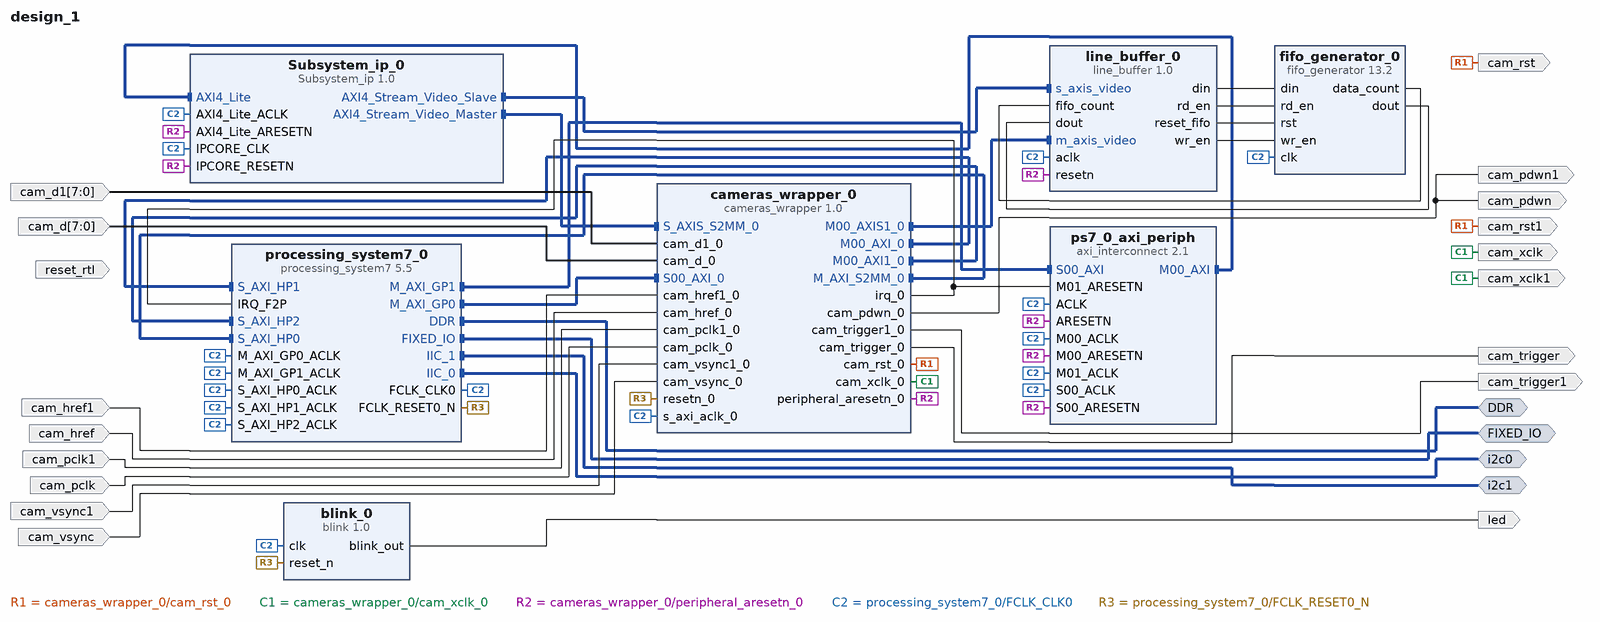
[diagram p0: block diagram of the top level]
# Vivado block design design_1, xc7z020clg400-3, Vivado 2019.1
create_bd_design design_1

create_bd_intf_port -mode Master -vlnv xilinx.com:interface:ddrx_rtl:1.0 DDR
create_bd_intf_port -mode Master -vlnv xilinx.com:display_processing_system7:fixedio_rtl:1.0 FIXED_IO
create_bd_intf_port -mode Master -vlnv xilinx.com:interface:iic_rtl:1.0 i2c0
create_bd_intf_port -mode Master -vlnv xilinx.com:interface:iic_rtl:1.0 i2c1
create_bd_port -dir I -from 7 -to 0 cam_d
create_bd_port -dir I -from 7 -to 0 cam_d1
create_bd_port -dir I cam_href
create_bd_port -dir I cam_href1
create_bd_port -dir I -type clk cam_pclk
create_bd_port -dir I -type clk cam_pclk1
create_bd_port -dir O cam_pdwn
create_bd_port -dir O cam_pdwn1
create_bd_port -dir O cam_rst
create_bd_port -dir O cam_rst1
create_bd_port -dir O cam_trigger
create_bd_port -dir O cam_trigger1
create_bd_port -dir I cam_vsync
create_bd_port -dir I cam_vsync1
create_bd_port -dir O -type clk cam_xclk
create_bd_port -dir O -type clk cam_xclk1
create_bd_port -dir O led
create_bd_port -dir I -type rst reset_rtl
set_property -dict {CONFIG.POLARITY ACTIVE_LOW} [get_bd_ports reset_rtl]

create_bd_cell -type ip -vlnv craftdrones:user:blink:1.0 blink_0
set_property -dict {CONFIG.max_count 50000000} [get_bd_cells blink_0]
create_bd_cell -type ip -vlnv xilinx.com:user:cameras_wrapper:1.0 cameras_wrapper_0
create_bd_cell -type ip -vlnv xilinx.com:ip:fifo_generator:13.2 fifo_generator_0
set_property -dict [list \
  CONFIG.Data_Count true \
  CONFIG.Data_Count_Width 12 \
  CONFIG.Enable_Safety_Circuit true \
  CONFIG.Full_Flags_Reset_Value 1 \
  CONFIG.Input_Data_Width 64 \
  CONFIG.Input_Depth 4096 \
  CONFIG.Output_Data_Width 64 \
  CONFIG.Reset_Type Asynchronous_Reset \
] [get_bd_cells fifo_generator_0]
create_bd_cell -type ip -vlnv xilinx.com:user:line_buffer:1.0 line_buffer_0
create_bd_cell -type ip -vlnv xilinx.com:ip:processing_system7:5.5 processing_system7_0
set_property -dict [list \
  CONFIG.PCW_APU_PERIPHERAL_FREQMHZ 667 \
  CONFIG.PCW_CPU_CPU_6X4X_MAX_RANGE 867 \
  CONFIG.PCW_ENET0_PERIPHERAL_ENABLE 0 \
  CONFIG.PCW_FPGA0_PERIPHERAL_FREQMHZ 50 \
  CONFIG.PCW_FPGA1_PERIPHERAL_FREQMHZ 10 \
  CONFIG.PCW_FPGA2_PERIPHERAL_FREQMHZ 10 \
  CONFIG.PCW_FPGA3_PERIPHERAL_FREQMHZ 10 \
  CONFIG.PCW_GPIO_EMIO_GPIO_ENABLE 1 \
  CONFIG.PCW_GPIO_EMIO_GPIO_IO 64 \
  CONFIG.PCW_GPIO_MIO_GPIO_ENABLE 1 \
  CONFIG.PCW_GPIO_MIO_GPIO_IO MIO \
  CONFIG.PCW_GPIO_PERIPHERAL_ENABLE 1 \
  CONFIG.PCW_I2C0_I2C0_IO EMIO \
  CONFIG.PCW_I2C0_PERIPHERAL_ENABLE 1 \
  CONFIG.PCW_I2C1_I2C1_IO EMIO \
  CONFIG.PCW_I2C1_PERIPHERAL_ENABLE 1 \
  CONFIG.PCW_I2C_PERIPHERAL_FREQMHZ 111.111115 \
  CONFIG.PCW_I2C_RESET_ENABLE 1 \
  CONFIG.PCW_I2C_RESET_SELECT {Share reset pin} \
  CONFIG.PCW_IRQ_F2P_INTR 1 \
  CONFIG.PCW_PERIPHERAL_BOARD_PRESET part0 \
  CONFIG.PCW_PRESET_BANK0_VOLTAGE {LVCMOS 1.8V} \
  CONFIG.PCW_PRESET_BANK1_VOLTAGE {LVCMOS 1.8V} \
  CONFIG.PCW_QSPI_GRP_FBCLK_ENABLE 1 \
  CONFIG.PCW_QSPI_GRP_FBCLK_IO {MIO 8} \
  CONFIG.PCW_QSPI_GRP_SINGLE_SS_ENABLE 1 \
  CONFIG.PCW_QSPI_GRP_SINGLE_SS_IO {MIO 1 .. 6} \
  CONFIG.PCW_QSPI_PERIPHERAL_ENABLE 1 \
  CONFIG.PCW_QSPI_QSPI_IO {MIO 1 .. 6} \
  CONFIG.PCW_SD0_GRP_CD_ENABLE 0 \
  CONFIG.PCW_SD0_GRP_WP_ENABLE 0 \
  CONFIG.PCW_SD0_PERIPHERAL_ENABLE 1 \
  CONFIG.PCW_SD0_SD0_IO {MIO 40 .. 45} \
  CONFIG.PCW_SD1_PERIPHERAL_ENABLE 1 \
  CONFIG.PCW_SD1_SD1_IO {MIO 10 .. 15} \
  CONFIG.PCW_SDIO_PERIPHERAL_FREQMHZ 100 \
  CONFIG.PCW_SINGLE_QSPI_DATA_MODE x4 \
  CONFIG.PCW_SPI1_PERIPHERAL_ENABLE 1 \
  CONFIG.PCW_SPI1_SPI1_IO {MIO 46 .. 51} \
  CONFIG.PCW_UART0_PERIPHERAL_ENABLE 1 \
  CONFIG.PCW_UART0_UART0_IO {MIO 50 .. 51} \
  CONFIG.PCW_UART1_PERIPHERAL_ENABLE 0 \
  CONFIG.PCW_UART_PERIPHERAL_FREQMHZ 50 \
  CONFIG.PCW_UIPARAM_DDR_FREQ_MHZ 400 \
  CONFIG.PCW_UIPARAM_DDR_MEMORY_TYPE {LPDDR 2} \
  CONFIG.PCW_UIPARAM_DDR_PARTNO Custom \
  CONFIG.PCW_USB0_PERIPHERAL_ENABLE 0 \
  CONFIG.PCW_USB_RESET_ENABLE 1 \
  CONFIG.PCW_USE_FABRIC_INTERRUPT 1 \
  CONFIG.PCW_USE_M_AXI_GP1 1 \
  CONFIG.PCW_USE_S_AXI_HP0 1 \
  CONFIG.PCW_USE_S_AXI_HP1 1 \
  CONFIG.PCW_USE_S_AXI_HP2 1 \
] [get_bd_cells processing_system7_0]
# 510 more settings of processing_system7_0 are not shown: defaults, MIO pin electricals, DDR timing, and values the tool derives
create_bd_cell -type ip -vlnv xilinx.com:ip:axi_interconnect:2.1 ps7_0_axi_periph
set_property -dict {CONFIG.ENABLE_ADVANCED_OPTIONS 0 CONFIG.NUM_MI 2} [get_bd_cells ps7_0_axi_periph]
create_bd_cell -type ip -vlnv xilinx.com:ip:Subsystem_ip:1.0 Subsystem_ip_0

# ---- connections ----

connect_bd_intf_net [get_bd_intf_pins Subsystem_ip_0/AXI4_Lite] [get_bd_intf_pins ps7_0_axi_periph/M00_AXI]
connect_bd_intf_net [get_bd_intf_pins Subsystem_ip_0/AXI4_Stream_Video_Master] [get_bd_intf_pins cameras_wrapper_0/S_AXIS_S2MM_0]
connect_bd_intf_net [get_bd_intf_pins Subsystem_ip_0/AXI4_Stream_Video_Slave] [get_bd_intf_pins line_buffer_0/s_axis_video]
connect_bd_intf_net [get_bd_intf_ports DDR] [get_bd_intf_pins processing_system7_0/DDR]
connect_bd_intf_net [get_bd_intf_ports FIXED_IO] [get_bd_intf_pins processing_system7_0/FIXED_IO]
connect_bd_intf_net [get_bd_intf_ports i2c1] [get_bd_intf_pins processing_system7_0/IIC_1]
connect_bd_intf_net [get_bd_intf_pins cameras_wrapper_0/S00_AXI_0] [get_bd_intf_pins processing_system7_0/M_AXI_GP0]
connect_bd_intf_net [get_bd_intf_pins processing_system7_0/M_AXI_GP1] [get_bd_intf_pins ps7_0_axi_periph/S00_AXI]
connect_bd_intf_net [get_bd_intf_pins cameras_wrapper_0/M00_AXI_0] [get_bd_intf_pins processing_system7_0/S_AXI_HP1]
connect_bd_intf_net [get_bd_intf_ports i2c0] [get_bd_intf_pins processing_system7_0/IIC_0]
connect_bd_intf_net [get_bd_intf_pins cameras_wrapper_0/M00_AXI1_0] [get_bd_intf_pins processing_system7_0/S_AXI_HP2]
connect_bd_intf_net [get_bd_intf_pins cameras_wrapper_0/M00_AXIS1_0] [get_bd_intf_pins line_buffer_0/m_axis_video]
connect_bd_intf_net [get_bd_intf_pins cameras_wrapper_0/M_AXI_S2MM_0] [get_bd_intf_pins processing_system7_0/S_AXI_HP0]
connect_bd_net [get_bd_pins blink_0/blink_out] [get_bd_ports led]
connect_bd_net -net cam_d1_1 [get_bd_ports cam_d1] [get_bd_pins cameras_wrapper_0/cam_d1_0]
connect_bd_net [get_bd_ports cam_d] [get_bd_pins cameras_wrapper_0/cam_d_0]
connect_bd_net -net cam_href1_1 [get_bd_ports cam_href1] [get_bd_pins cameras_wrapper_0/cam_href1_0]
connect_bd_net [get_bd_ports cam_href] [get_bd_pins cameras_wrapper_0/cam_href_0]
connect_bd_net -net cam_pclk1_1 [get_bd_ports cam_pclk1] [get_bd_pins cameras_wrapper_0/cam_pclk1_0]
connect_bd_net [get_bd_ports cam_pclk] [get_bd_pins cameras_wrapper_0/cam_pclk_0]
connect_bd_net -net cam_vsync1_1 [get_bd_ports cam_vsync1] [get_bd_pins cameras_wrapper_0/cam_vsync1_0]
connect_bd_net [get_bd_ports cam_vsync] [get_bd_pins cameras_wrapper_0/cam_vsync_0]
connect_bd_net [get_bd_pins cameras_wrapper_0/cam_pdwn_0] [get_bd_ports cam_pdwn] [get_bd_ports cam_pdwn1]
connect_bd_net [get_bd_pins cameras_wrapper_0/cam_rst_0] [get_bd_ports cam_rst] [get_bd_ports cam_rst1]
connect_bd_net [get_bd_pins cameras_wrapper_0/cam_trigger1_0] [get_bd_ports cam_trigger1]
connect_bd_net [get_bd_pins cameras_wrapper_0/cam_trigger_0] [get_bd_ports cam_trigger]
connect_bd_net [get_bd_pins cameras_wrapper_0/cam_xclk_0] [get_bd_ports cam_xclk] [get_bd_ports cam_xclk1]
connect_bd_net [get_bd_pins cameras_wrapper_0/irq_0] [get_bd_pins processing_system7_0/IRQ_F2P] [get_bd_pins ps7_0_axi_periph/M01_ARESETN]
connect_bd_net [get_bd_pins cameras_wrapper_0/peripheral_aresetn_0] \
  [get_bd_pins line_buffer_0/resetn] [get_bd_pins ps7_0_axi_periph/ARESETN] [get_bd_pins ps7_0_axi_periph/M00_ARESETN] \
  [get_bd_pins ps7_0_axi_periph/S00_ARESETN] [get_bd_pins Subsystem_ip_0/AXI4_Lite_ARESETN] \
  [get_bd_pins Subsystem_ip_0/IPCORE_RESETN]
connect_bd_net [get_bd_pins fifo_generator_0/data_count] [get_bd_pins line_buffer_0/fifo_count]
connect_bd_net [get_bd_pins fifo_generator_0/dout] [get_bd_pins line_buffer_0/dout]
connect_bd_net [get_bd_pins line_buffer_0/din] [get_bd_pins fifo_generator_0/din]
connect_bd_net [get_bd_pins line_buffer_0/rd_en] [get_bd_pins fifo_generator_0/rd_en]
connect_bd_net [get_bd_pins line_buffer_0/reset_fifo] [get_bd_pins fifo_generator_0/rst]
connect_bd_net [get_bd_pins line_buffer_0/wr_en] [get_bd_pins fifo_generator_0/wr_en]
connect_bd_net [get_bd_pins processing_system7_0/FCLK_CLK0] \
  [get_bd_pins blink_0/clk] [get_bd_pins cameras_wrapper_0/s_axi_aclk_0] [get_bd_pins fifo_generator_0/clk] \
  [get_bd_pins line_buffer_0/aclk] [get_bd_pins processing_system7_0/M_AXI_GP0_ACLK] \
  [get_bd_pins processing_system7_0/M_AXI_GP1_ACLK] [get_bd_pins processing_system7_0/S_AXI_HP0_ACLK] \
  [get_bd_pins processing_system7_0/S_AXI_HP1_ACLK] [get_bd_pins processing_system7_0/S_AXI_HP2_ACLK] \
  [get_bd_pins ps7_0_axi_periph/ACLK] [get_bd_pins ps7_0_axi_periph/M00_ACLK] [get_bd_pins ps7_0_axi_periph/M01_ACLK] \
  [get_bd_pins ps7_0_axi_periph/S00_ACLK] [get_bd_pins Subsystem_ip_0/AXI4_Lite_ACLK] [get_bd_pins Subsystem_ip_0/IPCORE_CLK]
connect_bd_net [get_bd_pins processing_system7_0/FCLK_RESET0_N] [get_bd_pins blink_0/reset_n] [get_bd_pins cameras_wrapper_0/resetn_0]

# ---- address map ----
assign_bd_address -offset 0x00000000 -range 1G -target_address_space [get_bd_addr_spaces cameras_wrapper_0/M00_AXI1_0] [get_bd_addr_segs processing_system7_0/S_AXI_HP2/HP2_DDR_LOWOCM]
assign_bd_address -offset 0x00000000 -range 1G -target_address_space [get_bd_addr_spaces cameras_wrapper_0/M00_AXI_0] [get_bd_addr_segs processing_system7_0/S_AXI_HP1/HP1_DDR_LOWOCM]
assign_bd_address -offset 0x00000000 -range 1G -target_address_space [get_bd_addr_spaces cameras_wrapper_0/M_AXI_S2MM_0] [get_bd_addr_segs processing_system7_0/S_AXI_HP0/HP0_DDR_LOWOCM]
assign_bd_address -offset 0x40000000 -range 1G -target_address_space [get_bd_addr_spaces processing_system7_0/Data] [get_bd_addr_segs cameras_wrapper_0/S00_AXI_0/reg0]
assign_bd_address -offset 0x81200000 -range 64K -target_address_space [get_bd_addr_spaces processing_system7_0/Data] [get_bd_addr_segs Subsystem_ip_0/AXI4_Lite/reg0]

set_property USER_COMMENTS.comment_0 {Connect M01_AXI to your custom IP} [current_bd_design]

validate_bd_design
save_bd_design
